# EAGLE schematic GBxCart_RW_Mini_v1.0_Schematic (EAGLE 6.4)
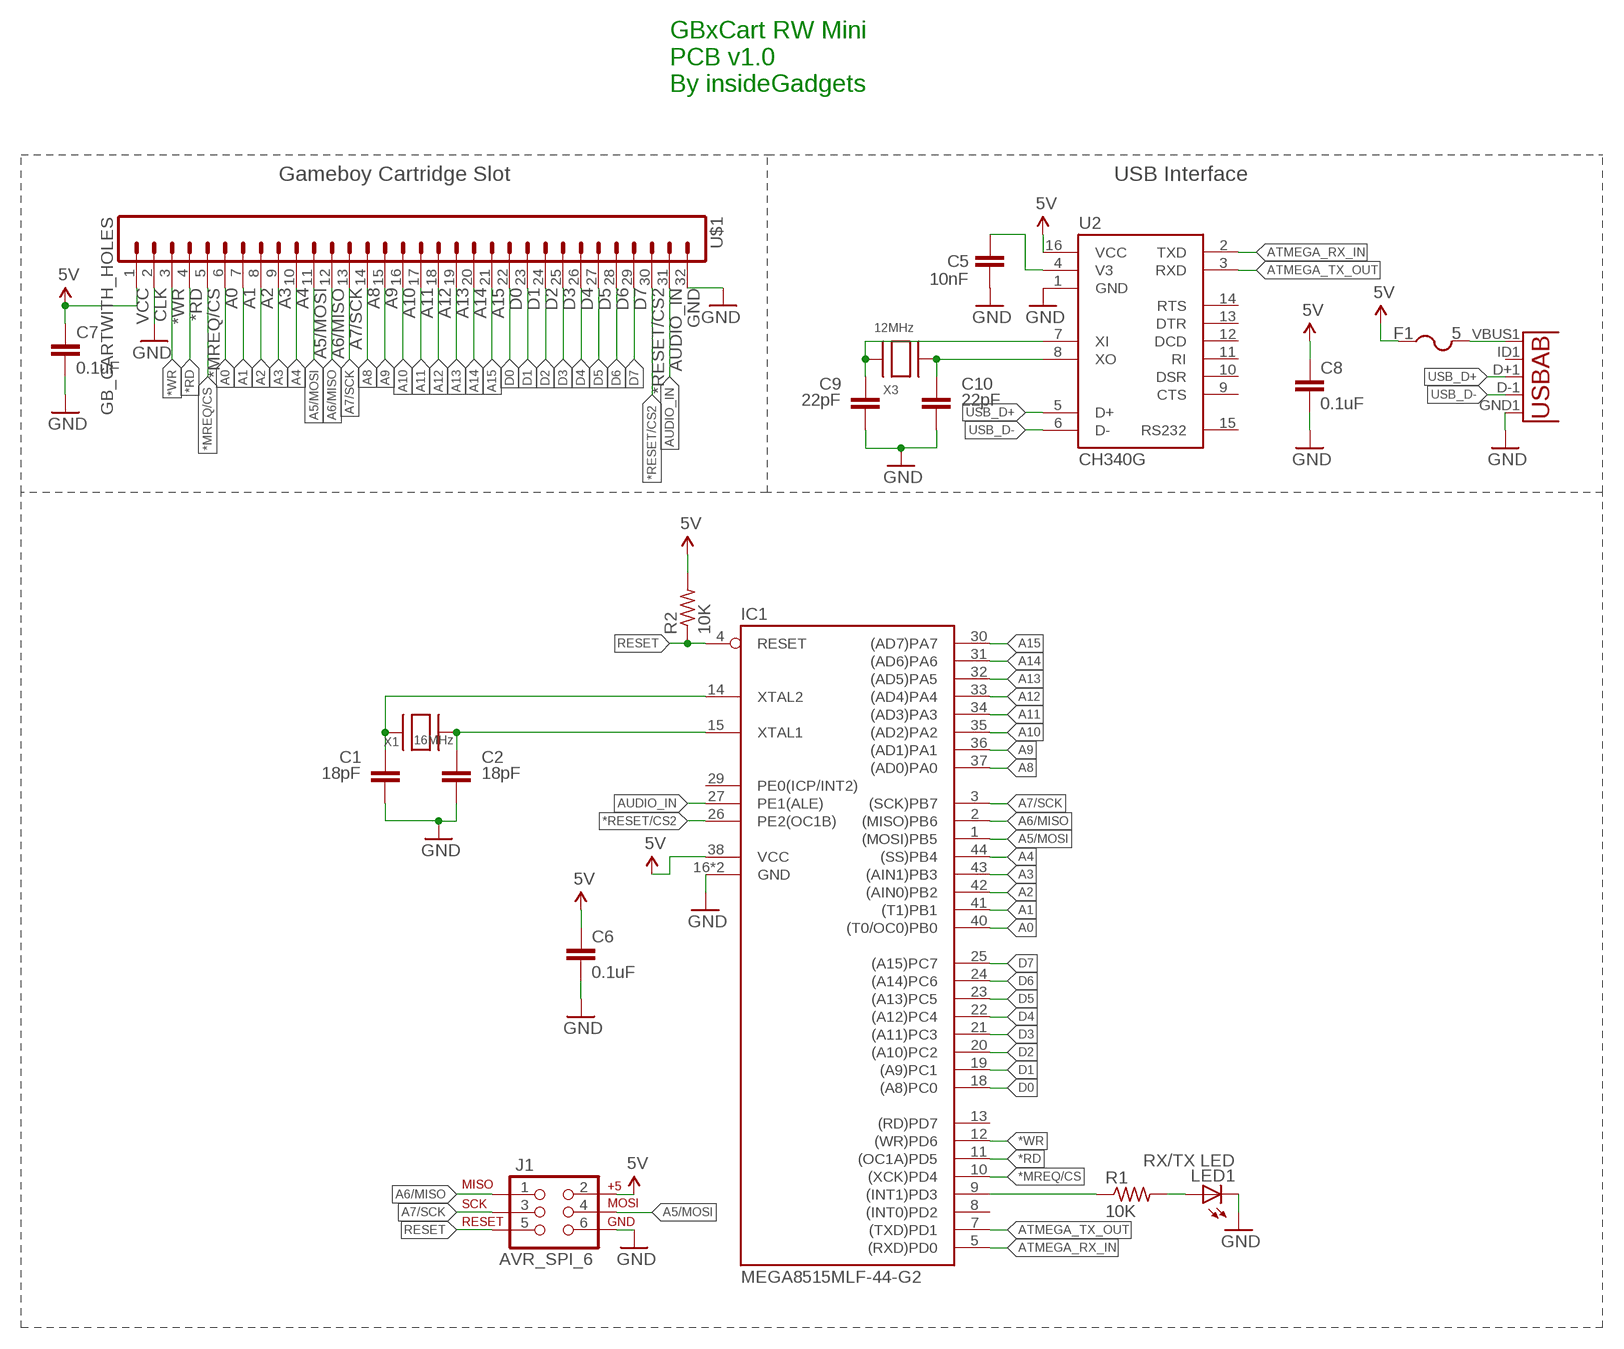
[diagram p0: schematic, sheet 1]

## Parts
C1  18pF  CAP0603  [C0603K]
C2  18pF  CAP0603  [C0603K]
C5  10nF  CAP0805  [C0805K]
C6  0.1uF  CAP0603  [C0603K]
C7  0.1uF  CAP0805  [C0805K]
C8  0.1uF  CAP0805  [C0805K]
C9  22pF  CAP0805  [C0805K]
C10  22pF  CAP0805  [C0805K]
F1  5  PTCFUSE-1206  [R1206]
IC1  MEGA8515MLF-44-G2  [MLF-44-G2]
J1  AVR_SPI_6  AVR_SPI_PRG_6  [2X3_2]
LED1  RX/TX LED  LEDCHIP-LED0805-NS  [CHIP-LED0805-NS]
R1  10K  R-US_R0805_2  [R0805_2]
R2  10K  R-US_R0603  [R0603]
U1  USBEP  [USB-MICRO-SMD-EXTRAPADS]
U2  CH340G  [SO16]
U$1  GB_CARTWITH_HOLES  [GB_CART_WHOLES]
X1  16MHz  XTAL3.2X2.5  [XTAL32-25]
X3  12MHz  XTAL3.2X2.5  [XTAL32-25]

## Nets
5V: C6.1 C7.1 C8.1 F1.1 IC1.38(VCC) J1.2 R2.2 U2.16(VCC) U$1.1
*MREQ/CS: IC1.10((XCK)PD4) U$1.5
*RD: IC1.11((OC1A)PD5) U$1.4
*RESET/CS2: IC1.26(PE2(OC1B)) U$1.30
*WR: IC1.12((WR)PD6) U$1.3
A0: IC1.40((T0/OC0)PB0) U$1.6
A1: IC1.41((T1)PB1) U$1.7
A2: IC1.42((AIN0)PB2) U$1.8
A3: IC1.43((AIN1)PB3) U$1.9
A4: IC1.44((SS)PB4) U$1.10
A5/MOSI: IC1.1((MOSI)PB5) J1.4 U$1.11
A6/MISO: IC1.2((MISO)PB6) J1.1 U$1.12
A7/SCK: IC1.3((SCK)PB7) J1.3 U$1.13
A8: IC1.37((AD0)PA0) U$1.14
A9: IC1.36((AD1)PA1) U$1.15
A10: IC1.35((AD2)PA2) U$1.16
A11: IC1.34((AD3)PA3) U$1.17
A12: IC1.33((AD4)PA4) U$1.18
A13: IC1.32((AD5)PA5) U$1.19
A14: IC1.31((AD6)PA6) U$1.20
A15: IC1.30((AD7)PA7) U$1.21
ATMEGA_RX_IN: IC1.5((RXD)PD0) U2.2(TXD)
ATMEGA_TX_OUT: IC1.7((TXD)PD1) U2.3(RXD)
AUDIO_IN: IC1.27(PE1(ALE)) U$1.31
D0: IC1.18((A8)PC0) U$1.22
D1: IC1.19((A9)PC1) U$1.23
D2: IC1.20((A10)PC2) U$1.24
D3: IC1.21((A11)PC3) U$1.25
D4: IC1.22((A12)PC4) U$1.26
D5: IC1.23((A13)PC5) U$1.27
D6: IC1.24((A14)PC6) U$1.28
D7: IC1.25((A15)PC7) U$1.29
GND: C1.2 C2.2 C5.2 C6.2 C7.2 C8.2 C9.2 C10.2 IC1.16(GND) IC1.45(GND) J1.6 LED1.C U1.GND1(GND) U2.1(GND) U$1.2 U$1.32
N$1: IC1.9((INT1)PD3) R1.1
N$4: C10.1 U2.8(XO) X3.2
N$7: F1.2 U1.VBUS1(VBUS)
N$18: LED1.A R1.2
RESET: IC1.4(RESET) J1.5 R2.1
USB_D+: U1.D+1(D+) U2.5(D+)
USB_D-: U1.D-1(D-) U2.6(D-)
V3: C5.1 U2.4(V3)
XTAL1: C9.1 U2.7(XI) X3.1
XTAL5: C1.1 IC1.14(XTAL2) X1.1
XTAL6: C2.1 IC1.15(XTAL1) X1.2
Unconnected: IC1.6(NC1) IC1.8((INT0)PD2) IC1.13((RD)PD7) IC1.17(NC2) IC1.28(NC3) IC1.29(PE0(ICP/INT2)) IC1.39(NC4) U1.ID1(USBID) U2.9(CTS) U2.10(DSR) U2.11(RI) U2.12(DCD) U2.13(DTR) U2.14(RTS) U2.15(RS232)

## Notes on the sheet
- GBxCart RW Mini
  PCB v1.0
  By insideGadgets
- Gameboy Cartridge Slot | USB Interface
- VCC | CLK

## Library data of the parts
C1 C2 C5-C10 = adafruit:CAP
F1 = adafruit:PTCFUSE: PTC fuses, resettable thermistors
IC1 = avr-5:MEGA8515: MICROCONTROLLER 8 Kbytes FLASH 512 bytes SRAM 512 bytes EEPROM USART 8-channel 10 bit ADC
J1 = SparkFun:AVR_SPI_PRG_6: AVR ISP 6 Pin This is the reduced ISP connector for AVR programming. Common on Arduino. This footprint will take up less PCB space and can be used with a 10-pin to 6-pin adapter such as SKU: BOB-08508
LED1 = adafruit:LED: LED OSRAM: - CHIPLED LG R971, LG N971, LY N971, LG Q971, LY Q971, LO R971, LY R971 LH N974, LH R974 LS Q976, LO Q976, LY Q976 LO Q996 - Hyper CHIPLED LW Q18S LB Q993, LB Q99A, LB R99A - SideLED LS A670, LO A670, LY A670, LG A670, LP A670 LB A673, LV A673, LT A673, LW A673 LH A674 LY A675 LS A676, LA A676, LO A676, LY A676, LW A676 LS A679, LY A679, LG A679 - Hyper Micro SIDELED® LS Y876, LA Y876, LO Y876, LY Y876 LT Y87S - SmartLED LW L88C, LW L88S LB L89C, LB L89S, LG L890 LS L89K, LO L89K, LY L89K LS L896, LA L896, LO L896, LY L896 - TOPLED LS T670, LO T670, LY T670, LG T670, LP T670 LSG T670, LSP T670, LSY T670, LOP T670, LYG T670 LG T671, LOG T671, LSG T671 LB T673, LV T673, LT T673, LW T673 LH T674 LS T676, LA T676, LO T676, LY T676, LB T676, LH T676, LSB T676, LW T676 LB T67C, LV T67C, LT T67C, LS T67K, LO T67K, LY T67K, LW E67C LS E67B, LA E67B, LO E67B, LY E67B, LB E67C, LV E67C, LT E67C LW T67C LS T679, LY T679, LG T679 LS T770, LO T770, LY T770, LG T770, LP T770 LB T773, LV T773, LT T773, LW T773 LH T774 LS E675, LA E675, LY E675, LS T675 LS T776, LA T776, LO T776, LY T776, LB T776 LHGB T686 LT T68C, LB T68C - Hyper Mini TOPLED® LB M676 - Mini TOPLED Santana® LG M470 LS M47K, LO M47K, LY M47K Source: http://www.osram.convergy.de/
R1 R2 = adafruit:R-US_: RESISTOR, American symbol
U1 = MicroUSB:USB: This is a USB AB connector that is compatible with USB OTG. i.e. this connector can serve as a host or device
U2 = alex:CH340G
U$1 = alex:GB_CART
X1 X3 = adafruit:XTAL: Low cost SMT crystals, no capacitors included http://www.ladyada.net/library/eagle